# Altium project sd_103.PrjPcb
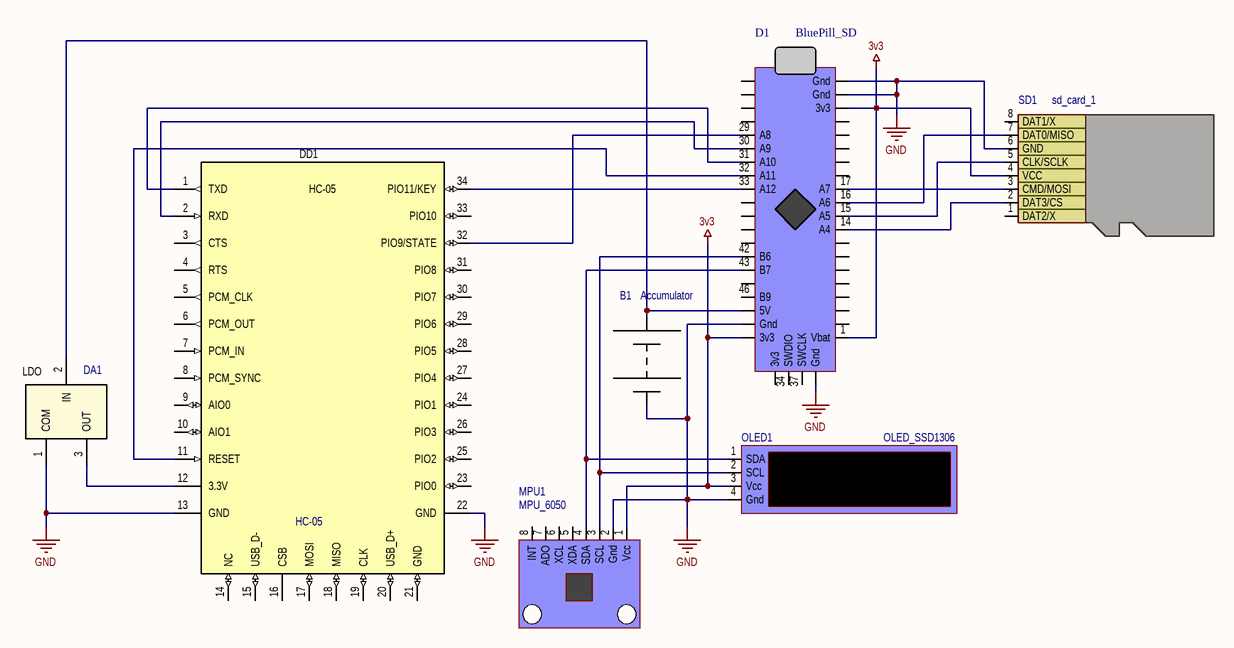
[diagram p0: sd_103.SchDoc]
1 sheet, 7 parts. Net scope: global (net labels, ports and power ports of the same name join across sheets).
Board file: sd_103.PcbDoc

## Sheet sd_103.SchDoc
size 420 x 297 mm

### Parts
B1  Accumulator
D1  BluePill_SD
DA1  MCP1703T-3302E/CB  [SOT-23A_MCP]  (value not drawn)
DD1  HC-05
MPU1  MPU_6050
OLED1  OLED_SSD1306
SD1  sd_card_1

### Nets
3v3: D1.1(Vbat) D1.?7(3v3) D1.?27(3v3) MPU1.1(Vcc) OLED1.3(Vcc) SD1.4(VCC)
GND: B1.?1(Gnd) D1.?1(Gnd) D1.?6(Gnd) D1.?26(Gnd) D1.?29(Gnd) DA1.1(COM) DD1.13(GND) DD1.22(GND) MPU1.2(Gnd) OLED1.4(Gnd) SD1.6(GND)
NetB1_?2: B1.?2(3v7) D1.?25(5V) DA1.2(IN)
NetD1_14: D1.14(A4) SD1.2(DAT3/CS)
NetD1_15: D1.15(A5) SD1.5(CLK/SCLK)
NetD1_16: D1.16(A6) SD1.7(DAT0/MISO)
NetD1_17: D1.17(A7) SD1.3(CMD/MOSI)
NetD1_29: D1.29(A8) DD1.32(PIO9/STATE)
NetD1_30: D1.30(A9) DD1.2(RXD)
NetD1_31: D1.31(A10) DD1.1(TXD)
NetD1_32: D1.32(A11) DD1.11(RESET)
NetD1_33: D1.33(A12) DD1.34(PIO11/KEY)
NetD1_42: D1.42(B6) MPU1.3(SCL) OLED1.2(SCL)
NetD1_43: D1.43(B7) MPU1.4(SDA) OLED1.1(SDA)
NetDA1_3: DA1.3(OUT) DD1.12(3.3V)

Not connected (* = marked no-connect by the designer): D1 34(SWDIO) 37(SWCLK) 46(B9) ?2 ?3 ?4 ?5 ?8 ?9 ?10 ?11 ?12 ?13 ?14 ?15 ?16 ?17 ?18 ?19 ?20 ?21 ?22 ?23 ?24 ?28(3v3); DD1 3(CTS) 4(RTS) 5(PCM_CLK) 6(PCM_OUT) 7(PCM_IN) 8(PCM_SYNC) 9(AIO0) 10(AIO1) 14(NC) 15(USB_D-) 16(CSB) 17(MOSI) 18(MISO) 19(CLK) 20(USB_D+) 21(GND) 23(PIO0) 24(PIO1) 25(PIO2) 26(PIO3) 27(PIO4) 28(PIO5) 29(PIO6) 30(PIO7) 31(PIO8) 33(PIO10); MPU1 5(XDA) 6(XCL) 7(ADO) 8(INT); SD1 1(DAT2/X) 8(DAT1/X)

### Notes on the sheet
- THIS DOCUMENT AND THE DATA DISCLOSED HEREIN OR
- HEREWITH IS THE PROPERTY OF ALTIUM LIMITED AND MAY
- DWG NO:
- REVISION
- REV:
- DESCRIPTION
- DATE
- APPROVED
- BE FREELY DISTRIBUTED IN WHOLE. NO RIGHTS ARE
- RESERVED OR EXPRESS OR IMPLIED WARANTEE GIVEN.
- ENG:
- APPROVALS
- PROJECT
- DSN:
- CHK:
- REFERENCE DOCUMENTS
- PROJECT REVISION:
- TITLE
- DOCUMENT REVISION:
- DESIGN ITEM:
- BOM:
- FAB DWG:
- PCB DWG:
- ASSY DWG:
- SCALE:
- A3
- SIZE
- CAGE CODE
- FILE NAME
- DWG NO.
- SHEET
- OF
- REV

### Library data of the parts
DA1 = LDO_SOT23: Value: 3.3V; Name: MCP1703T-3302E/CB; Link1: https://www.chipdip.ru/product/mcp1703t-3302e-cb-3; Type: LDO
DD1 = HC-05: Bluetooth module; Name: HC-05; Link1: *; Type: Module